# Altium project H743-Levels.PrjPcb
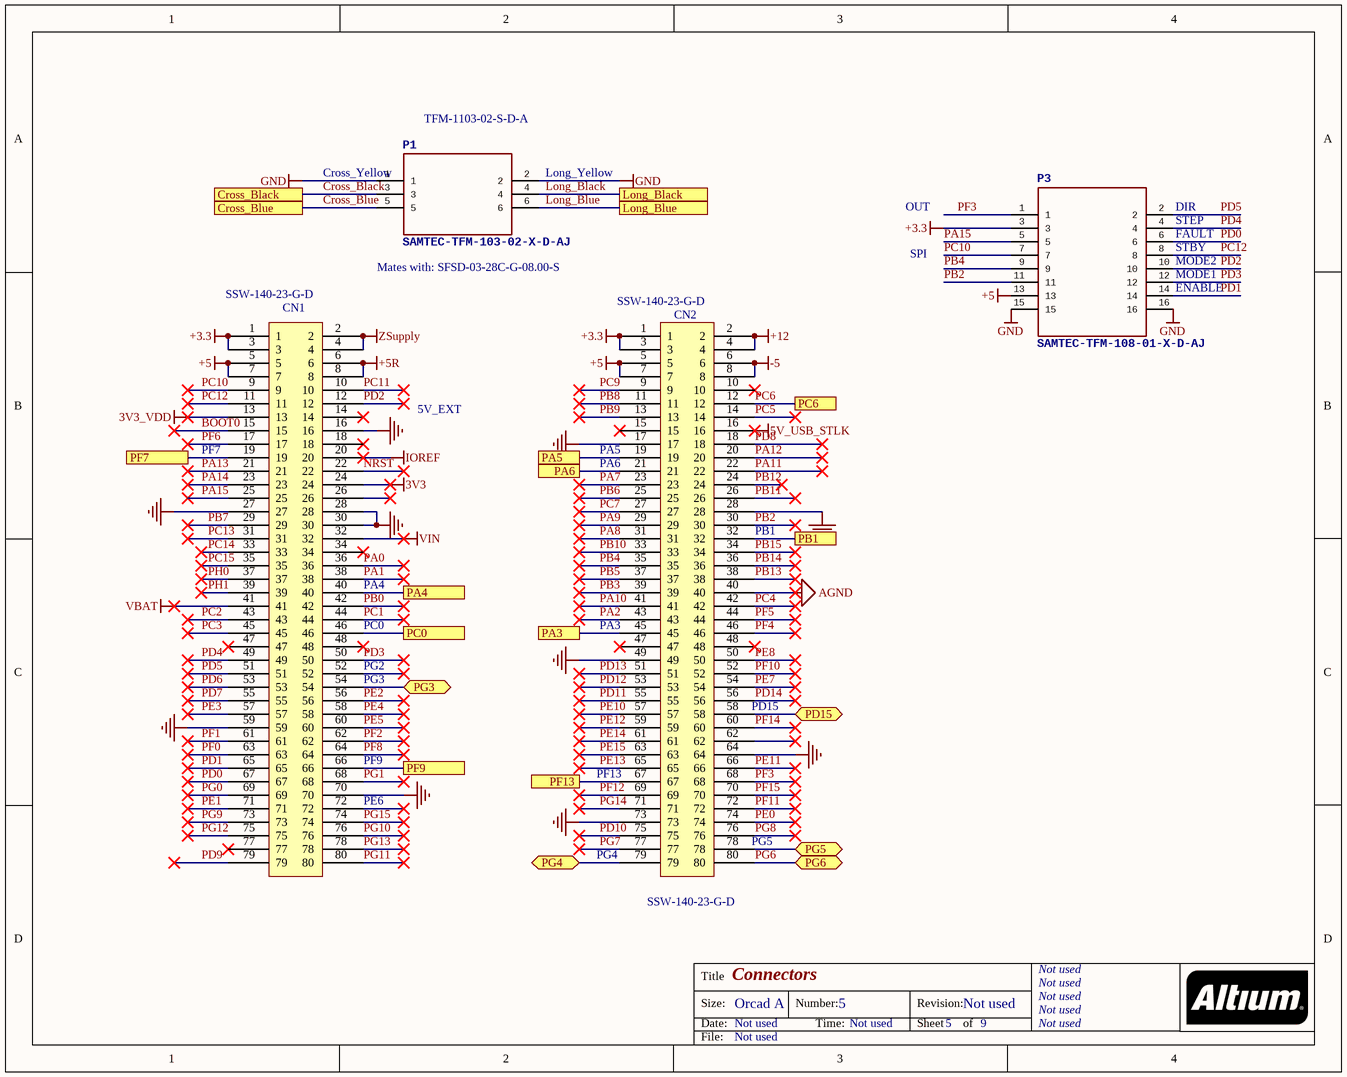
[diagram p0: Connectors.SchDoc]
Board_Assembly_Revision: 01; Board_Document_Date: 17-DEC-2018; Board_Name: NUCLEO 144 H7 LEGACY; Board_PCB_Revision: C; Board_Reference: MB1364
3 sheets, 66 parts. Net scope: flat (ports and power ports of the same name join across sheets).
Board file: MB1364.PcbDoc
Sheets:
  Connectors.SchDoc
  Levels.SchDoc
  Heaters.SchDoc

## Sheet Connectors.SchDoc: Connectors
size OrCAD A; Date: Not used; ApprovedBy: Not used; CheckedBy: Not used; Author: Not used; CompanyName: STMicroelectronics; DrawnBy: Not used; Engineer: Not used; Organization: Not used; Address1: Not used; Address2: Not used; Address3: Not used; Address4: Not used; DocumentNumber: 5; Revision: Not used; SheetNumber: 5; SheetTotal: 9; CurrentTime: Not used; CurrentDate: Not used; Time: Not used; DocumentFullPathAndName: Not used; DocumentName: Not used; ModifiedDate: Not used; ImagePath: Not used; ProjectName: Not used; Application_BuildNumber: Not used

### Parts
CN1  SSW-140-23-G-D  [SSW-140-23-G-D]
CN2  SSW-140-23-G-D  [SSW-140-23-G-D]
P1  SAMTEC-TFM-103-02-X-D-AJ  [SAMTEC-TFM-103-02-X-D-A]
P3  SAMTEC-TFM-108-01-X-D-AJ  [SAMTEC-TFM-108-01-X-D-A]

### Ports
Cross_Black, Cross_Blue, Long_Black, Long_Blue, PA3, PA4, PA5, PA6, PB1, PC0, PC6, PD15, PF7, PF9, PF13, PG3, PG4, PG5, PG6

### Nets
3V3: CN1.24
3V3_VDD: CN1.13
5V_USB_STLK: CN2.16
+3.3: CN1.1 CN1.3 CN2.1 CN2.3 P3.3
+5: CN1.5 CN1.7 CN2.5 CN2.7 P3.13
+5R: CN1.6 CN1.8
+12: CN2.2 CN2.4
-5: CN2.6 CN2.8
AGND: CN2.40
GND: CN1.16 CN1.27 CN1.28 CN1.30 CN1.59 CN1.70 CN2.17 CN2.28 CN2.49 CN2.64 CN2.73 P1.1 P1.2 P3.15 P3.16
IOREF: CN1.20
VBAT: CN1.41
VIN: CN1.32
ZSupply: CN1.2 CN1.4
BOOT0: CN1.15
Cross_Black: P1.3 ; port Cross_Black
Cross_Blue: P1.5 ; port Cross_Blue
Long_Black: P1.4 ; port Long_Black
Long_Blue: P1.6 ; port Long_Blue
NRST: CN1.22
PA0: CN1.36
PA1: CN1.38
PA2: CN2.43
PA3: CN2.45 ; port PA3
PA4: CN1.40 ; port PA4
PA5: CN2.19 ; port PA5
PA6: CN2.21 ; port PA6
PA7: CN2.23
PA8: CN2.31
PA9: CN2.29
PA10: CN2.41
PA11: CN2.22
PA12: CN2.20
PA13: CN1.21
PA14: CN1.23
PA15: CN1.25 P3.5
PB0: CN1.42
PB1: CN2.32 ; port PB1
PB2: CN2.30 P3.11
PB3: CN2.39
PB4: CN2.35 P3.9
PB5: CN2.37
PB6: CN2.25
PB7: CN1.29
PB8: CN2.11
PB9: CN2.13
PB10: CN2.33
PB11: CN2.26
PB12: CN2.24
PB13: CN2.38
PB14: CN2.36
PB15: CN2.34
PC0: CN1.46 ; port PC0
PC1: CN1.44
PC2: CN1.43
PC3: CN1.45
PC4: CN2.42
PC5: CN2.14
PC6: CN2.12 ; port PC6
PC7: CN2.27
PC9: CN2.9
PC10: CN1.9 P3.7
PC11: CN1.10
PC12: CN1.11 P3.8
PC13: CN1.31
PC14: CN1.33
PC15: CN1.35
PD0: CN1.67 P3.6
PD1: CN1.65 P3.14
PD2: CN1.12 P3.10
PD3: CN1.50 P3.12
PD4: CN1.49 P3.4
PD5: CN1.51 P3.2
PD6: CN1.53
PD7: CN1.55
PD8: CN2.18
PD9: CN1.79
PD10: CN2.75
PD11: CN2.55
PD12: CN2.53
PD13: CN2.51
PD14: CN2.56
PD15: CN2.58 ; port PD15
PE0: CN2.74
PE1: CN1.71
PE2: CN1.56
PE3: CN1.57
PE4: CN1.58
PE5: CN1.60
PE7: CN2.54
PE8: CN2.50
PE10: CN2.57
PE11: CN2.66
PE12: CN2.59
PE13: CN2.65
PE14: CN2.61
PE15: CN2.63
PF0: CN1.63
PF1: CN1.61
PF2: CN1.62
PF3: CN2.68 P3.1
PF4: CN2.46
PF5: CN2.44
PF6: CN1.17
PF7: CN1.19 ; port PF7
PF8: CN1.64
PF9: CN1.66 ; port PF9
PF10: CN2.52
PF11: CN2.72
PF12: CN2.69
PF13: CN2.67 ; port PF13
PF14: CN2.60
PF15: CN2.70
PG0: CN1.69
PG1: CN1.68
PG3: CN1.54 ; port PG3
PG4: CN2.79 ; port PG4
PG5: CN2.78 ; port PG5
PG6: CN2.80 ; port PG6
PG7: CN2.77
PG8: CN2.76
PG9: CN1.73
PG10: CN1.76
PG11: CN1.80
PG12: CN1.75
PG13: CN1.78
PG14: CN2.71
PG15: CN1.74
PH0: CN1.37
PH1: CN1.39

Not connected (* = marked no-connect by the designer): CN1 14* 18* 26* 34* 47* 48* 52* 72* 77*; CN2 10* 15* 47* 48* 62*

### Notes on the sheet
- TFM-1103-02-S-D-A
- (near P1) Cross_Yellow
- (near P1) Long_Yellow
- OUT
- (near P3) DIR
- Mates with: SFSD-03-28C-G-08.00-S
- SPI
- (near P3) STEP
- (near P3) FAULT
- (near P3) STBY
- (near P3) MODE2
- (near P3) MODE1
- (near P3) ENABLE
- 5V_EXT
- (near CN1) PF7
- (near CN2) PA6
- (near CN2) PA5
- (near CN2) PB1
- (near CN1) PA4
- (near CN1) PG2
- (near CN1) PG3
- (near CN1) PC0
- (near CN2) PA3
- (near CN2) PD15
- (near CN1) PE6
- (near CN1) PF9
- (near CN2) PF13
- (near CN2) PG4
- (near CN2) PG5
- Title
- Size:
- Date:
- Orcad A
- Number:
- Time:
- Revision:
- Sheet
- of
- File:

### Library data of the parts
CN1 CN2 = SSW-140-23-G-D: 80 Position Receptacle Connector Through Hole; Manufacturer: Samtec; Number of Contacts: 80; Gender: Female; Pitch: 2.54mm; Supplier 1: Avnet; Supplier Part Number 1: SSW-140-23-G-D; Manufacturer Part Number: SSW-140-23-G-D; Stock 1: 0; Pricing 1: 1=13.99000, 10=13.29000, 25=12.59000, 50=12.09000, 100=11.29000 (USD); RoHS: Yes; Mount: Through Hole; Contact Plating: Gold; Number of Rows: 2; Packaging: Bulk; Termination: Solder; Radiation Hardening: No; ComponentLink1URL: http://www.samtec.com/documents/webfiles/pdf/SSQ_TH.PDF?src-supplier=Avnet; ComponentLink1Description: http://www.samtec.com/documents/webfiles/pdf/SSQ_TH.PDF?src-supplier=Avnet

## Sheet Levels.SchDoc
size Tabloid
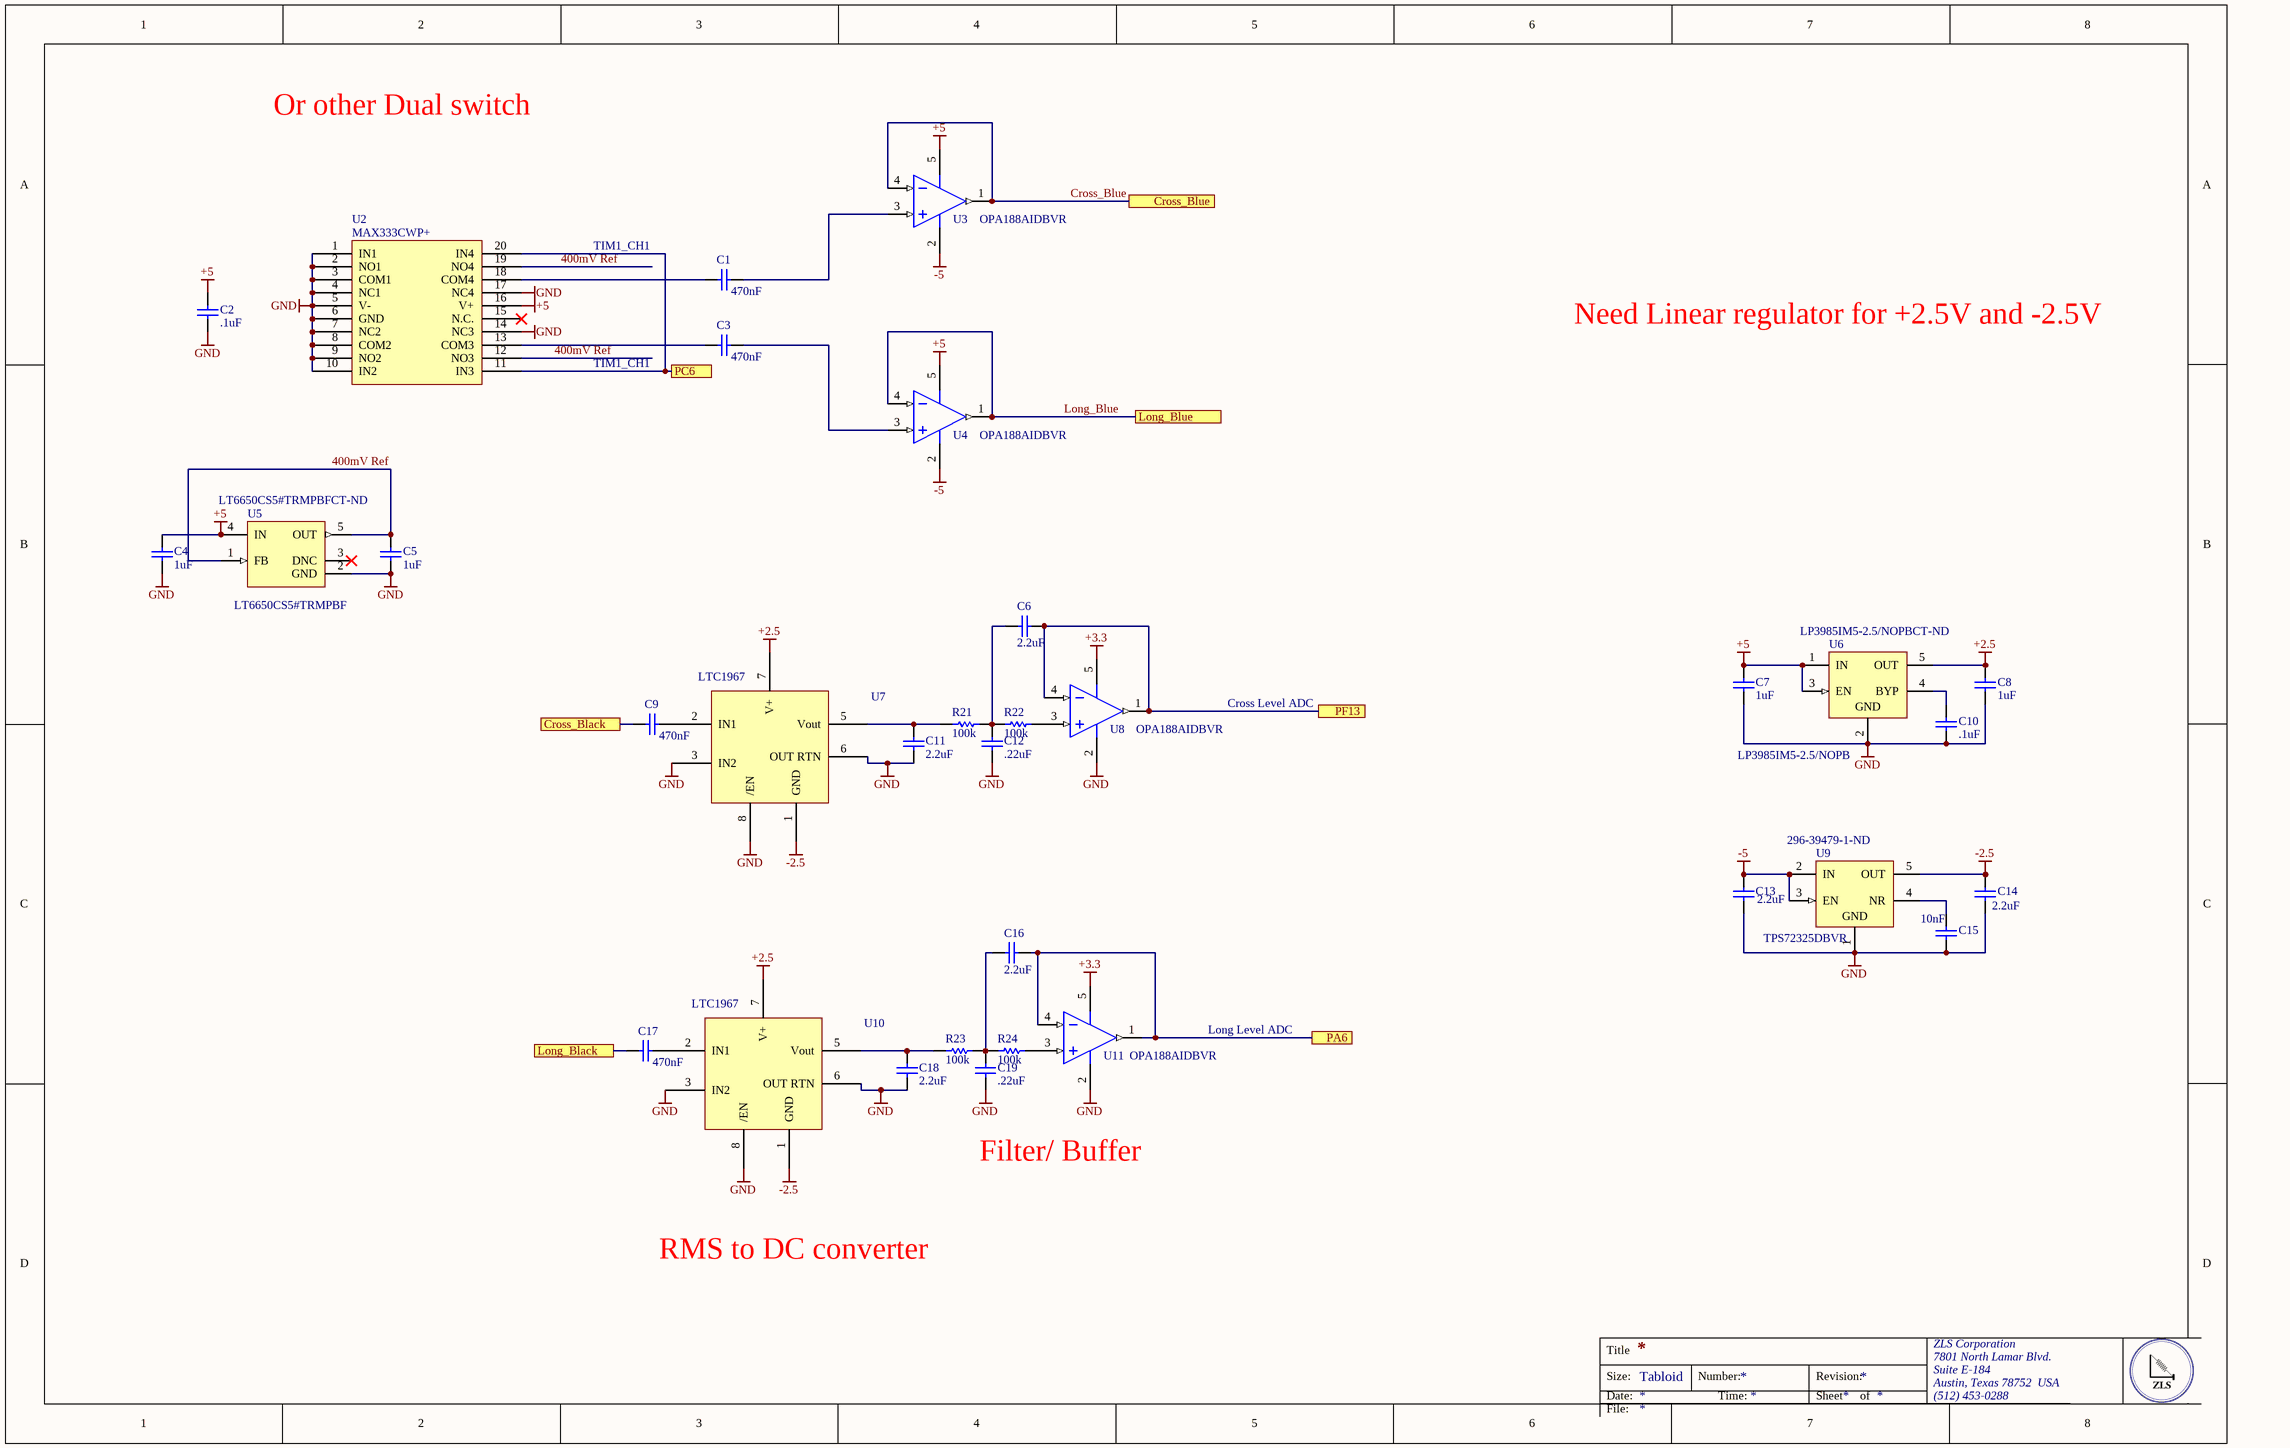
[diagram p1: Levels.SchDoc]

### Parts
C1  470nF  [CAPC0805(2012)75_L]
C2  .1uF  [CAPC0805(2012)75_L]
C3  470nF  [CAPC0805(2012)75_L]
C4  Capacitance: 1uF  [CAPC0805(2012)145_N]  (hidden comment: 08053C105JAT2A)
C5  Capacitance: 1uF  [CAPC0805(2012)145_N]  (hidden comment: 08053C105JAT2A)
C6  2.2uF  [CAPC0805(2012)75_L]
C7  Capacitance: 1uF  [CAPC0805(2012)145_N]  (hidden comment: 08053C105JAT2A)
C8  Capacitance: 1uF  [CAPC0805(2012)145_N]  (hidden comment: 08053C105JAT2A)
C9  470nF  [CAPC0805(2012)75_L]
C10  .1uF  [CAPC0805(2012)75_L]
C11  2.2uF  [CAPC0805(2012)75_L]
C12  .22uF  [CAPC0805(2012)75_L]
C13  Capacitance: 2.2uF  [CAPC2013X135X50ML10T20]  (hidden comment: GRM21BR71A225KA01L)
C14  Capacitance: 2.2uF  [CAPC2013X135X50ML10T20]  (hidden comment: GRM21BR71A225KA01L)
C15  Capacitance: 10nF  [CAPC2013X140X50NL20T25]  (hidden comment: 0805ZC103KAT2A)
C16  2.2uF  [CAPC0805(2012)75_L]
C17  470nF  [CAPC0805(2012)75_L]
C18  2.2uF  [CAPC0805(2012)75_L]
C19  .22uF  [CAPC0805(2012)75_L]
R21  100k  [RESC0805(2012)_L]
R22  100k  [RESC0805(2012)_L]
R23  100k  [RESC0805(2012)_L]
R24  100k  [RESC0805(2012)_L]
U2  MAX333CWP+  [TSOP65P640X90-20N]
U3  OPA188AIDBVR  [DBV0005A_M]
U4  OPA188AIDBVR  [DBV0005A_M]
U5  LT6650CS5#TRMPBF  Supplier Part Number 1: LT6650CS5#TRMPBFCT-ND  [LT-S5-5-TSOT-23_N]
U6  LP3985IM5-2.5/NOPB  Supplier Part Number 1: LP3985IM5-2.5/NOPBCT-ND  [DBV0005A_M]
U7  LTC1967  [LTC1967]
U8  OPA188AIDBVR  [DBV0005A_M]
U9  TPS72325DBVR  Supplier Part Number 1: 296-39479-1-ND  [DBV0005A_N]
U10  LTC1967  [LTC1967]
U11  OPA188AIDBVR  [DBV0005A_M]

### Ports
Cross_Black, Cross_Blue, Long_Black, Long_Blue, PA6, PC6, PF13

### Nets
+2.5: C8.2 U6.5(OUT) U7.7(V+) U10.7(V+)
+3.3: U8.5(V+) U11.5(V+)
+5: C2.2 C4.2 C7.2 U2.16(V+) U3.5(V+) U4.5(V+) U5.4(IN) U6.1(IN) U6.3(EN)
-2.5: C14.2 U7.1(GND) U9.5(OUT) U10.1(GND)
-5: C13.2 U3.2(V-) U4.2(V-) U9.2(IN) U9.3(EN)
GND: C2.1 C4.1 C5.1 C7.1 C8.1 C10.1 C11.1 C12.1 C13.1 C14.1 C15.1 C18.1 C19.1 U2.1(IN1) U2.2(NO1) U2.3(COM1) U2.4(NC1) U2.5(V-) U2.6(GND) U2.7(NC2) U2.8(COM2) U2.9(NO2) U2.10(IN2) U2.14(NC3) U2.17(NC4) U5.2(GND) U6.2(GND) U7.3(IN2) U7.6(OUT_RTN) U7.8(/EN) U8.2(V-) U9.1(GND) U10.3(IN2) U10.6(OUT_RTN) U10.8(/EN) U11.2(V-)
400mV Ref: C5.2 U2.12(NO3) U2.19(NO4) U5.1(FB) U5.5(OUT)
Cross_Black: C9.1 ; port Cross_Black
Cross_Blue: U3.1(OUT) U3.4(IN-) ; port Cross_Blue
Long_Black: C17.1 ; port Long_Black
Long_Blue: U4.1(OUT) U4.4(IN-) ; port Long_Blue
PA6: C16.1 U11.1(OUT) U11.4(IN-) ; port PA6
PC6: U2.11(IN3) U2.20(IN4) ; port PC6
PF13: C6.1 U8.1(OUT) U8.4(IN-) ; port PF13
NetC1_1: C1.1 U2.18(COM4)
NetC1_2: C1.2 U3.3(IN+)
NetC3_1: C3.1 U2.13(COM3)
NetC3_2: C3.2 U4.3(IN+)
NetC6_2: C6.2 C12.2 R21.1 R22.2
NetC9_2: C9.2 U7.2(IN1)
NetC10_2: C10.2 U6.4(BYP)
NetC11_2: C11.2 R21.2 U7.5(Vout)
NetC15_2: C15.2 U9.4(NR)
NetC16_2: C16.2 C19.2 R23.1 R24.2
NetC17_2: C17.2 U10.2(IN1)
NetC18_2: C18.2 R23.2 U10.5(Vout)
NetR22_1: R22.1 U8.3(IN+)
NetR24_1: R24.1 U11.3(IN+)

Not connected (* = marked no-connect by the designer): U2 15(N.C.)*; U5 3(DNC)*; U7 4(NC); U10 4(NC)

### Notes on the sheet
- Or other Dual switch
- TIM1_CH1
- Need Linear regulator for +2.5V and -2.5V
- Cross Level ADC
- Long Level ADC
- Filter/ Buffer
- RMS to DC converter
- Title
- Size:
- Date:
- Tabloid
- Number:
- Time:
- Revision:
- Sheet
- of
- ZLS Corporation
- 7801 North Lamar Blvd.
- Suite E-184
- Austin, Texas 78752  USA
- (512) 453-0288
- File:

### Library data of the parts
C1 C3 C9 C17 = CMP-1036-02117-1: CAP 150pF 16V ±10% 0805 (2012 Metric) Thickness 0.75mm SMD; Case-EIA: 0805; Tolerance: Â±10%; Value: .47uF; Case-Metric: 2012; Technology: SMT; Max Thickness: 0.75 mm; Rated Voltage: 16 V
C2 = CMP-1036-02117-1: CAP 150pF 16V ±10% 0805 (2012 Metric) Thickness 0.75mm SMD; Case-EIA: 0805; Tolerance: Â±10%; Case-Metric: 2012; Technology: SMT; Max Thickness: 0.75 mm; Rated Voltage: 16 V; Value: .1uF
C4 C5 C7 C8 = CMP-1036-04752-1: 1µF ±5% 25V Ceramic Capacitor X7R 0805 (2012 Metric); Manufacturer: Kyocera AVX; Tolerance: Â±5%; Case-Metric: 2012; Case-EIA: 0805; Value: 1uF; Technology: SMT; Rated Voltage: 25 V; Max Thickness: 1.45 mm; Supplier 1: Digi-Key; Supplier Part Number 1: 478-10487-1-ND; Manufacturer Part Number: 08053C105JAT2A; Stock 1: 13701; Pricing 1: 1=0.44000, 10=0.30400, 100=0.18220, 500=0.13662, 1000=0.11537 (USD); RoHS: Yes; Mount: Surface Mount; Case/Package: 0805; Number of Pins: 2; Case Code (Metric): 2012; Case Code (Imperial): 0805; Contact Plating: Tin; Min Operating Temperature: -55°C; Max Operating Temperature: 125°C; Packaging: Tape and Reel; Voltage Rating: 25V; Package Quantity: 2000; Dielectric: X7R; Voltage Rating (DC): 25V; Termination: SMD/SMT; Length: 2.01mm; Height: 1.4mm; Width: 0.049inch; Thickness: 0.037inch; Depth: 1.25mm; Radiation Hardening: No; Lead Free: Lead Free; REACH SVHC: Unknown; ComponentLink1URL: https://datasheet.ciiva.com/221/cx7r-221690.pdf?src-supplier=Digi-Key; ComponentLink1Description: https://datasheet.ciiva.com/221/cx7r-221690.pdf?src-supplier=Digi-Key; ComponentLink2URL: https://datasheet.ciiva.com/5419/cx7r-218113-5419770.pdf?src-supplier=Mouser; ComponentLink2Description: https://datasheet.ciiva.com/5419/cx7r-218113-5419770.pdf?src-supplier=Mouser; ComponentLink3URL: https://datasheet.ciiva.com/28586/1679506-28586091.pdf?src-supplier=Element14; ComponentLink3Description: https://datasheet.ciiva.com/28586/1679506-28586091.pdf?src-supplier=Element14; ComponentLink4URL: https://datasheet.ciiva.com/11499/cx7r-11499836.pdf?src-supplier=Avnet; ComponentLink4Description: https://datasheet.ciiva.com/11499/cx7r-11499836.pdf?src-supplier=Avnet
C6 C11 C12 C16 C18 C19 = CMP-1036-02117-1: CAP 150pF 16V ±10% 0805 (2012 Metric) Thickness 0.75mm SMD; Case-EIA: 0805; Tolerance: Â±10%; Value: 1uF; Case-Metric: 2012; Technology: SMT; Max Thickness: 0.75 mm; Rated Voltage: 16 V
C10 = CMP-1036-02117-1: 0.1µF ±10% 25V Ceramic Capacitor X7R 0805 (2012 Metric); Manufacturer: Vishay; Manufacturer Part Number: VJ0805Y104KXXCW1BC; Dielectric Material: Tantalum; Capacitance: 100nF; Supplier 1: Digi-Key; Supplier Part Number 1: 720-1537-1-ND; Stock 1: 72674; Pricing 1: 1=0.26000, 10=0.17900, 100=0.10120, 500=0.07142, 1000=0.06250 (USD); RoHS: Yes; Mount: Surface Mount; Case/Package: 0805; Number of Pins: 2; Weight: 0.000194oz; Case Code (Imperial): 0805; Case Code (Metric): 2012; Min Operating Temperature: -55°C; Max Operating Temperature: 125°C; Tolerance: 10%; Packaging: Tape and Reel; Package Quantity: 4000; Voltage Rating: 25V; Dielectric: X7R; Voltage Rating (DC): 25V; Termination: SMD/SMT; Length: 2mm; Height: 1.45mm; Width: 1.25mm; Thickness: 0.037inch; Depth: 1.25mm; Lead Free: Lead Free; ComponentLink1URL: https://datasheet.ciiva.com/11491/vjw1bcbascomseries-11491758.pdf?src-supplier=Avnet; ComponentLink1Description: https://datasheet.ciiva.com/11491/vjw1bcbascomseries-11491758.pdf?src-supplier=Avnet; ComponentLink2URL: https://datasheet.ciiva.com/176/vjw1bcbascomseries-176875.pdf?src-supplier=Digi-Key; ComponentLink2Description: https://datasheet.ciiva.com/176/vjw1bcbascomseries-176875.pdf?src-supplier=Digi-Key
C13 C14 = CMP-2007-03454-1: 2.2µF ±10% 10V Ceramic Capacitor X7R 0805 (2012 Metric); Manufacturer: Murata; Dissipation Factor: 0.035%; Part Number: GRM21BR71A225KA01L; Supplier 1: Digi-Key; Supplier Part Number 1: 490-1696-1-ND; Manufacturer Part Number: GRM21BR71A225KA01L; Stock 1: 271684; Pricing 1: 1=0.27000, 10=0.18600, 100=0.09440, 500=0.06458, 1000=0.05713 (USD); RoHS: Yes; Mount: Surface Mount; Case/Package: 0805; Number of Pins: 2; Case Code (Imperial): 0805; Case Code (Metric): 2012; Min Operating Temperature: -55°C; Max Operating Temperature: 125°C; Tolerance: 10%; Packaging: Tape and Reel; Package Quantity: 1; Voltage Rating: 10V; Dielectric: X7R; Voltage Rating (DC): 10V; Termination: SMD/SMT; Voltage: 10V; Length: 2mm; Height: 1.25mm; Width: 1.25mm; Thickness: 0.053inch; Depth: 1.25mm; Radiation Hardening: No; REACH SVHC: No SVHC; Lead Free: Lead Free; ComponentLink1URL: https://datasheet.ciiva.com/2989/product-2989712.pdf?src-supplier=Avnet; ComponentLink1Description: https://datasheet.ciiva.com/2989/product-2989712.pdf?src-supplier=Avnet; ComponentLink2URL: https://datasheet.ciiva.com/3778/grm21br71a225ka0123-3778504.pdf?src-supplier=Arrow; ComponentLink2Description: https://datasheet.ciiva.com/3778/grm21br71a225ka0123-3778504.pdf?src-supplier=Arrow; ComponentLink3URL: https://datasheet.ciiva.com/11786/0900766b80936815-11786251.pdf?src-supplier=RSComponents; ComponentLink3Description: https://datasheet.ciiva.com/11786/0900766b80936815-11786251.pdf?src-supplier=RSComponents; ComponentLink4URL: https://datasheet.ciiva.com/16203/product-16203815.pdf?src-supplier=Future+Electronics; ComponentLink4Description: https://datasheet.ciiva.com/16203/product-16203815.pdf?src-supplier=Future+Electronics; ComponentLink5URL: https://datasheet.ciiva.com/135/partnumbering-e-01-135064.pdf?src-supplier=Digi-Key; ComponentLink5Description: https://datasheet.ciiva.com/135/partnumbering-e-01-135064.pdf?src-supplier=Digi-Key; ComponentLink6URL: https://datasheet.ciiva.com/135/partnumbering-e-01-135065.pdf?src-supplier=Digi-Key; ComponentLink6Description: https://datasheet.ciiva.com/135/partnumbering-e-01-135065.pdf?src-supplier=Digi-Key; ComponentLink7URL: https://datasheet.ciiva.com/135/partnumbering-e-01-135066.pdf?src-supplier=Digi-Key; ComponentLink7Description: https://datasheet.ciiva.com/135/partnumbering-e-01-135066.pdf?src-supplier=Digi-Key; ComponentLink8URL: https://datasheet.ciiva.com/22703/608985-22703358.pdf?src-supplier=Element14; ComponentLink8Description: https://datasheet.ciiva.com/22703/608985-22703358.pdf?src-supplier=Element14; ComponentLink9URL: https://datasheet.ciiva.com/2989/product-2989711.pdf?src-supplier=Avnet; ComponentLink9Description: https://datasheet.ciiva.com/2989/product-2989711.pdf?src-supplier=Avnet
C15 = CMP-2007-04770-1: 10000pF ±10% 10V Ceramic Capacitor X7R 0805 (2012 Metric); Manufacturer: AVX Interconnect / Elco; Part Number: 0805ZC103KAT2A; Supplier 1: Digi-Key; Supplier Part Number 1: 478-11396-1-ND; Manufacturer Part Number: 0805ZC103KAT2A; Stock 1: 11980; Pricing 1: 1=0.32000, 10=0.21700, 100=0.11010, 500=0.07534, 1000=0.06665 (USD); RoHS: Yes; Mount: Surface Mount; Case/Package: 0805; Number of Pins: 2; Case Code (Metric): 2012; Case Code (Imperial): 0805; Min Operating Temperature: -55°C; Max Operating Temperature: 125°C; Tolerance: 10%; Packaging: Tape and Reel; Termination: SMD/SMT; Package Quantity: 4000; Dielectric: X7R; Voltage Rating (DC): 10V; Voltage Rating: 10V; Length: 2.01mm; Width: 0.049inch; Depth: 1.25mm; Thickness: 0.037inch; Radiation Hardening: No; REACH SVHC: Unknown; ComponentLink1URL: https://datasheet.ciiva.com/205/cx7r-205251.pdf?src-supplier=Digi-Key; ComponentLink1Description: https://datasheet.ciiva.com/205/cx7r-205251.pdf?src-supplier=Digi-Key; ComponentLink2URL: https://datasheet.ciiva.com/11508/cx7r-11508056.pdf?src-supplier=Avnet; ComponentLink2Description: https://datasheet.ciiva.com/11508/cx7r-11508056.pdf?src-supplier=Avnet; ComponentLink3URL: https://datasheet.ciiva.com/17489/cx7r-17489036.pdf?src-supplier=Avnet+Europe; ComponentLink3Description: https://datasheet.ciiva.com/17489/cx7r-17489036.pdf?src-supplier=Avnet+Europe; ComponentLink4URL: https://datasheet.ciiva.com/5420/cx7r-5420079.pdf?src-supplier=Mouser; ComponentLink4Description: https://datasheet.ciiva.com/5420/cx7r-5420079.pdf?src-supplier=Mouser
R21-R24 = CMP-1013-00215-1: 2R55 0.125W 1% 0805 (2012 Metric)  SMD; Case-Metric: 2012; Case-EIA: 0805; Value: 100k; Tolerance: 1 %; Technology: SMT; Power: 0.125 W
U2 = MAX333CWP+: IC SWITCH QUAD SPDT 20TSSOP; Manufacturer: Maxim; Manufacturer Part Number: MAX333AEUP+; Max Supply Voltage: 30V; Min Supply Voltage: 10V; Min Dual Supply Voltage: 4.5V; Max Dual Supply Voltage: 20V; On-State Resistance: 35R; Operating Supply Current: 1uA; Supply Type: Single,Dual; Max Power Dissipation: 559mW; Turn-On Delay Time: 175ns; Turn-Off Delay Time: 145ns; Max Supply Current: 250uA; Number of Bits: 4; Dual Supply Voltage: 15V; Supplier 1: Mouser; Supplier Part Number 1: 700-MAX333AEUP; Stock 1: 664; Pricing 1: 1=6.77, 10=6.43, 50=5.8, 100=5.8, 1000=5.62, 10000=5.62 (USD); Case/Package: TSSOP; Number of Pins: 20; Weight: 0.006737oz; Min Operating Temperature: -40°C; Max Operating Temperature: 85°C; Packaging: Rail/Tube; Package Quantity: 74; Throw Configuration: SPDT; Number of Channels: 4; Length: 6.6mm; Height: 0.95mm; Width: 4.5mm; Radiation Hardening: No; Lead Free: Lead Free; REACH SVHC: Unknown; ComponentLink1URL: https://datasheet.ciiva.com/2978/max333a-2978850.pdf; ComponentLink1Description: https://datasheet.ciiva.com/2978/max333a-2978850.pdf; ComponentLink2URL: https://datasheet.ciiva.com/30478/0900766b81253c85-30478260.pdf; ComponentLink2Description: https://datasheet.ciiva.com/30478/0900766b81253c85-30478260.pdf; ComponentLink3URL: https://datasheet.ciiva.com/1674/max333a-1674617.pdf; ComponentLink3Description: https://datasheet.ciiva.com/1674/max333a-1674617.pdf; ComponentLink4URL: https://datasheet.ciiva.com/26825/max333aeup-26825546.pdf; ComponentLink4Description: https://datasheet.ciiva.com/26825/max333aeup-26825546.pdf
U3 U4 U8 U11 = CMP-0809-00005-2: Precision, Low Noise, Rail-to-Rail Output, Zero-Drift Operational Amplifier, 4 to 36 V, -40 to 125 degC, 5-pin SOT23 (DBV5), Green (RoHS & no Sb/Br); Manufacturer: Texas Instruments; Total Supply Voltage(Min)(+5V is 5, +/-5V is 10): 4; Offset Drift(Typ)(uV/C): 0.03; Rating: Catalog; SubFamily: Zero Drift Precision Amplifier; GBW(Typ)(MHz): 2; Slew Rate(Typ)(V/us): 0.8; Number of Channels: 1; CMRR(Min)(dB): 120; Iq per channel(Max)(mA): 0.51; Total Supply Voltage(Max)(+5V is 5, +/-5V is 10): 36; PartNumber: OPA188AIDBVR; ComponentLink2Description: Datasheet; ComponentLink2URL: http://www.ti.com/lit/ds/symlink/opa188.pdf; ComponentLink1Description: Manufacturer URL; Mounting Technology: Surface Mount; Eco-Plan: Green (RoHS & no Sb/Br); ComponentLink1URL: http://www.ti.com/; PackageVersion: 4073253-4/K, 03/2006; DatasheetVersion: SBOS642A; ComponentLink3Description: Package Specification; PackageReference: DBV0005A; ComponentLink3URL: http://www.ti.com/litv/pdf/mpds018i; PackageDescription: 5-Pin Plastic Small Outline, Body 1.6 x 2.9 mm, Pitch 0.95 mm; Code_JEDEC: MO-178
U5 = CMP-1567-00007-1: Micropower, 400 mV Reference with Rail-to-Rail Buffer Amplifier, 1.4 to 18 V, 0 to 70 degC, 5-Pin SOT-23 (S5), RoHS, Tape and Reel; Manufacturer: Analog Devices / Linear Technology; VIN Max: 18 V; VIN Min: 1.4 V; Number of Channels: 1; Tolerance: 0.75%; Max Input Voltage: 18V; Min Input Voltage: 1.4V; Output Voltage: 400mV; Temperature Coefficient: 30ppm/°C; Quiescent Current: 15uA; Output Current: 200uA; Reference Type: Series; PackageVersion: Rev. B, 06/2010; ComponentLink1Description: Manufacturer URL; Mounting Technology: Surface Mount; PartNumber: LT6650CS5#TRMPBF; Packing: Tape and Reel; PackageDescription: 5-Pin Plastic Thin Small Out-Line Transistor, Body 1.63 x 2.90 mm, Pitch 0.95 mm; Code_JEDEC: MO-193; Temperature Max: 70 degC; ComponentLink2Description: Datasheet; ComponentLink2URL: http://cds.linear.com/docs/en/datasheet/6650fa.pdf; ComponentLink3URL: http://cds.linear.com/docs/en/packaging/SOT_5_05-08-1635.pdf; ComponentLink1URL: http://www.linear.com/; RoHS: TRUE; ComponentLink3Description: Package Specification; Temperature Min: 0 degC; Supplier 1: Digi-Key; Manufacturer Part Number: LT6650CS5#TRMPBF; Stock 1: 3771; Pricing 1: 1=3.18000, 25=2.11040, 100=1.74480, 250=1.65756 (USD); Case/Package: SOT-23-5; Number of Pins: 5; Min Operating Temperature: 0°C; Max Operating Temperature: 70°C; Package Quantity: 1; Packaging: Tape and Reel; Length: 2.9mm; Height: 0.9mm; Width: 1.75mm; Lead Free: Lead Free; ComponentLink4URL: https://datasheet.ciiva.com/6594/1196-6594366.pdf?src-supplier=Digi-Key; ComponentLink4Description: https://datasheet.ciiva.com/6594/1196-6594366.pdf?src-supplier=Digi-Key; ComponentLink5URL: https://datasheet.ciiva.com/48694/001256472-da-01-en-ic-vref-s-lt6650cs5-trmpbf-tsot-23-5-ltc-48694695.pdf?src-supplier=Conrad; ComponentLink5Description: https://datasheet.ciiva.com/48694/001256472-da-01-en-ic-vref-s-lt6650cs5-trmpbf-tsot-23-5-ltc-48694695.pdf?src-supplier=Conrad
U6 = CMP-0062-01907-3: Micropower, 150mA Low-Noise Ultra Low-Dropout CMOS Voltage Regulator, 5-pin SOT-23, Pb-Free; Manufacturer: Texas Instruments; PackageTopMarking: LCSB*XTT; PowerWise: N; CompType: LDO IC; Max Input Voltage: 6V; Output Voltage: 2.5V; Number of Outputs: 1; Max Power Dissipation: 250mW; Polarity: Positive; Quiescent Current: 150uA; Accuracy: 2%; Output Type: Fixed; Dropout Voltage: 60mV; Current Rating: 150A; ComponentLink1Description: Datasheet URL; PinCount: 5; RoHS: Y; PackageDescription: Molded SOT-23, .115 x .063 x .040 in Body, 5 Lead, .0375 in Pitch; ComponentLink1URL: http://www.ti.com/general/docs/lit/getliterature.tsp?genericPartNumber=LP3985&fileType=pdf; PackageReference: DBV0005A; Supplier 1: Digi-Key; Manufacturer Part Number: LP3985IM5-2.5/NOPB; Stock 1: 16680; Pricing 1: 1=0.66000, 10=0.57800, 100=0.44300, 500=0.35020 (USD); Mount: Surface Mount; Case/Package: SOT-23; Number of Pins: 5; Contact Plating: Tin; Min Operating Temperature: -40°C; Max Operating Temperature: 125°C; Max Output Current: 150mA; Min Input Voltage: 2.5V; Output Current: 150mA; Packaging: Tape and Reel; Power Dissipation: 250mW; Output Voltage Accuracy: 2%; Nominal Output Voltage: 2.5V; Termination: SMD/SMT; Max Supply Voltage: 6V; Min Supply Voltage: 2.5V; Max Output Voltage: 2.5V; Length: 2.92mm; Height: 1.02mm; Width: 1.6mm; Lead Free: Lead Free; REACH SVHC: No SVHC; ComponentLink2URL: https://datasheet.ciiva.com/46441/10171-46441111.pdf?src-supplier=Element14; ComponentLink2Description: https://datasheet.ciiva.com/46441/10171-46441111.pdf?src-supplier=Element14; ComponentLink3URL: https://datasheet.ciiva.com/49047/1882660-49047100.pdf?src-supplier=Element14; ComponentLink3Description: https://datasheet.ciiva.com/49047/1882660-49047100.pdf?src-supplier=Element14; ComponentLink4URL: https://datasheet.ciiva.com/46383/1882660-46383391.pdf?src-supplier=Element14; ComponentLink4Description: https://datasheet.ciiva.com/46383/1882660-46383391.pdf?src-supplier=Element14
U7 U10 = LTC1967: IC CONVERTER RMS-DC PREC 9MSOP
U9 = CMP-0394-00292-2: Single Output High PSRR LDO, 200 mA, Fixed -2.5 V Output, -10 to -2.7 V Input, 5-pin SOT-23 (DBV), -40 to 125 degC, Green (RoHS & no Sb/Br); Manufacturer: Texas Instruments; Iout(Max)(A): 0.2; Iq(Typ)(mA): 0.13; Accuracy(%): 2; Vdo(Typ)(mV): 280; SubFamily: Single Channel LDO; Number of Outputs: 1; Output Voltage: -2.5V; Max Power Dissipation: 560mW; Dropout Voltage: 280mV; Output Current: 200mA; Max Input Voltage: -2.7V; Min Input Voltage: -10V; Min Current Limit: 300mA; Input Bias Current: 130uA; Polarity: Negative; Output Voltage Accuracy: 1%; Accuracy: 2%; Vin(Max)(V): -2.7; PartNumber: TPS72325DBVR; PackageReference: DBV0005A; ComponentLink3Description: Package Specification; Fixed Output Options(V): -2.5; ComponentLink1URL: http://www.ti.com/; ComponentLink1Description: Manufacturer URL; Mounting Technology: Surface Mount; PackageDescription: 5-Pin Plastic Small Outline, Body 1.60 Ãƒâ€” 2.90 mm, Pitch 0.95 mm; ComponentLink2URL: http://www.ti.com/general/docs/lit/getliterature.tsp?genericPartNumber=TPS72325&fileType=pdf; PackageVersion: 4073253-4/K; ComponentLink3URL: http://www.ti.com/litv/pdf/mpds018i; Vout Adj(Min)(V): -2.5; ComponentLink2Description: Datasheet; Vout Adj(Max)(V): -2.5; Eco-Plan: Green (RoHS & no Sb/Br); DatasheetVersion: SLVS346B; Vin(Min)(V): -10; Code_JEDEC: MO-178; Supplier 1: Digi-Key; Manufacturer Part Number: TPS72325DBVR; Stock 1: 6951; Pricing 1: 1=2.81000, 10=2.52200, 100=2.02720, 500=1.66552, 1000=1.37999 (USD); RoHS: Yes; Case/Package: SOT-23; Number of Pins: 5; Contact Plating: Tin; Min Operating Temperature: -40°C; Max Operating Temperature: 125°C; Packaging: Tape and Reel; Package Quantity: 3000; Max Output Current: 200mA; Number of Regulators: 1; Power Dissipation: 560mW; Min Output Voltage: -2.5V; Quiescent Current: 130uA; Max Output Voltage: -2.5V; Output Type: Fixed; Nominal Output Voltage: -2.5V; Radiation Hardening: No; Lead Free: Lead Free; REACH SVHC: No SVHC; ComponentLink4URL: http://www.mouser.com/ds/2/405/slvs346c-521947.pdf?src-supplier=Mouser; ComponentLink4Description: http://www.mouser.com/ds/2/405/slvs346c-521947.pdf?src-supplier=Mouser; ComponentLink5URL: http://components.arrow.com/part/dataview/0323_00141856?src-supplier=Arrow+Europe; ComponentLink5Description: http://components.arrow.com/part/dataview/0323_00141856?src-supplier=Arrow+Europe; ComponentLink6URL: http://www.ti.com/general/docs/lit/getliterature.tsp?genericPartNumber=TPS723&amp;&amp;fileType=pdf&src-supplier=Newark; ComponentLink6Description: http://www.ti.com/general/docs/lit/getliterature.tsp?genericPartNumber=TPS723&amp;&amp;fileType=pdf&src-supplier=Newark; ComponentLink7URL: http://focus.ti.com/lit/ds/symlink/tps72325.pdf?src-supplier=Avnet+Europe; ComponentLink7Description: http://focus.ti.com/lit/ds/symlink/tps72325.pdf?src-supplier=Avnet+Europe; ComponentLink8URL: http://www.ti.com/general/docs/lit/getliterature.tsp?genericPartNumber=TPS723&amp;&amp;fileType=pdf&src-supplier=Farnell; ComponentLink8Description: http://www.ti.com/general/docs/lit/getliterature.tsp?genericPartNumber=TPS723&amp;&amp;fileType=pdf&src-supplier=Farnell; ComponentLink9URL: http://www.ti.com/general/docs/lit/getliterature.tsp?genericPartNumber=TPS723&&fileType=pdf&src-supplier=Avnet+Asia; ComponentLink9Description: http://www.ti.com/general/docs/lit/getliterature.tsp?genericPartNumber=TPS723&&fileType=pdf&src-supplier=Avnet+Asia; ComponentLink10URL: http://www.ti.com/general/docs/lit/getliterature.tsp?genericPartNumber=TPS723&&fileType=pdf&src-supplier=Avnet; ComponentLink10Description: http://www.ti.com/general/docs/lit/getliterature.tsp?genericPartNumber=TPS723&&fileType=pdf&src-supplier=Avnet; ComponentLink11URL: http://components.arrow.com/part/dataview/40177093S9611537N7713?src-supplier=Arrow; ComponentLink11Description: http://components.arrow.com/part/dataview/40177093S9611537N7713?src-supplier=Arrow; ComponentLink12URL: http://www.ti.com/lit/ds/symlink/tps723.pdf?src-supplier=Digi-Key; ComponentLink12Description: http://www.ti.com/lit/ds/symlink/tps723.pdf?src-supplier=Digi-Key; ComponentLink13URL: http://www.ti.com/general/docs/lit/getliterature.tsp?genericPartNumber=TPS723&&fileType=pdf&src-supplier=Element14; ComponentLink13Description: http://www.ti.com/general/docs/lit/getliterature.tsp?genericPartNumber=TPS723&&fileType=pdf&src-supplier=Element14; ComponentLink14URL: http://www.ti.com/lit/ds/symlink/tps72301.pdf?src-supplier=Digi-Key; ComponentLink14Description: http://www.ti.com/lit/ds/symlink/tps72301.pdf?src-supplier=Digi-Key

## Sheet Heaters.SchDoc: Land Meter Heater Assembly
size Tabloid; DocumentNumber: LM_HTR_001; Revision: A; SheetNumber: 1; SheetTotal: 1
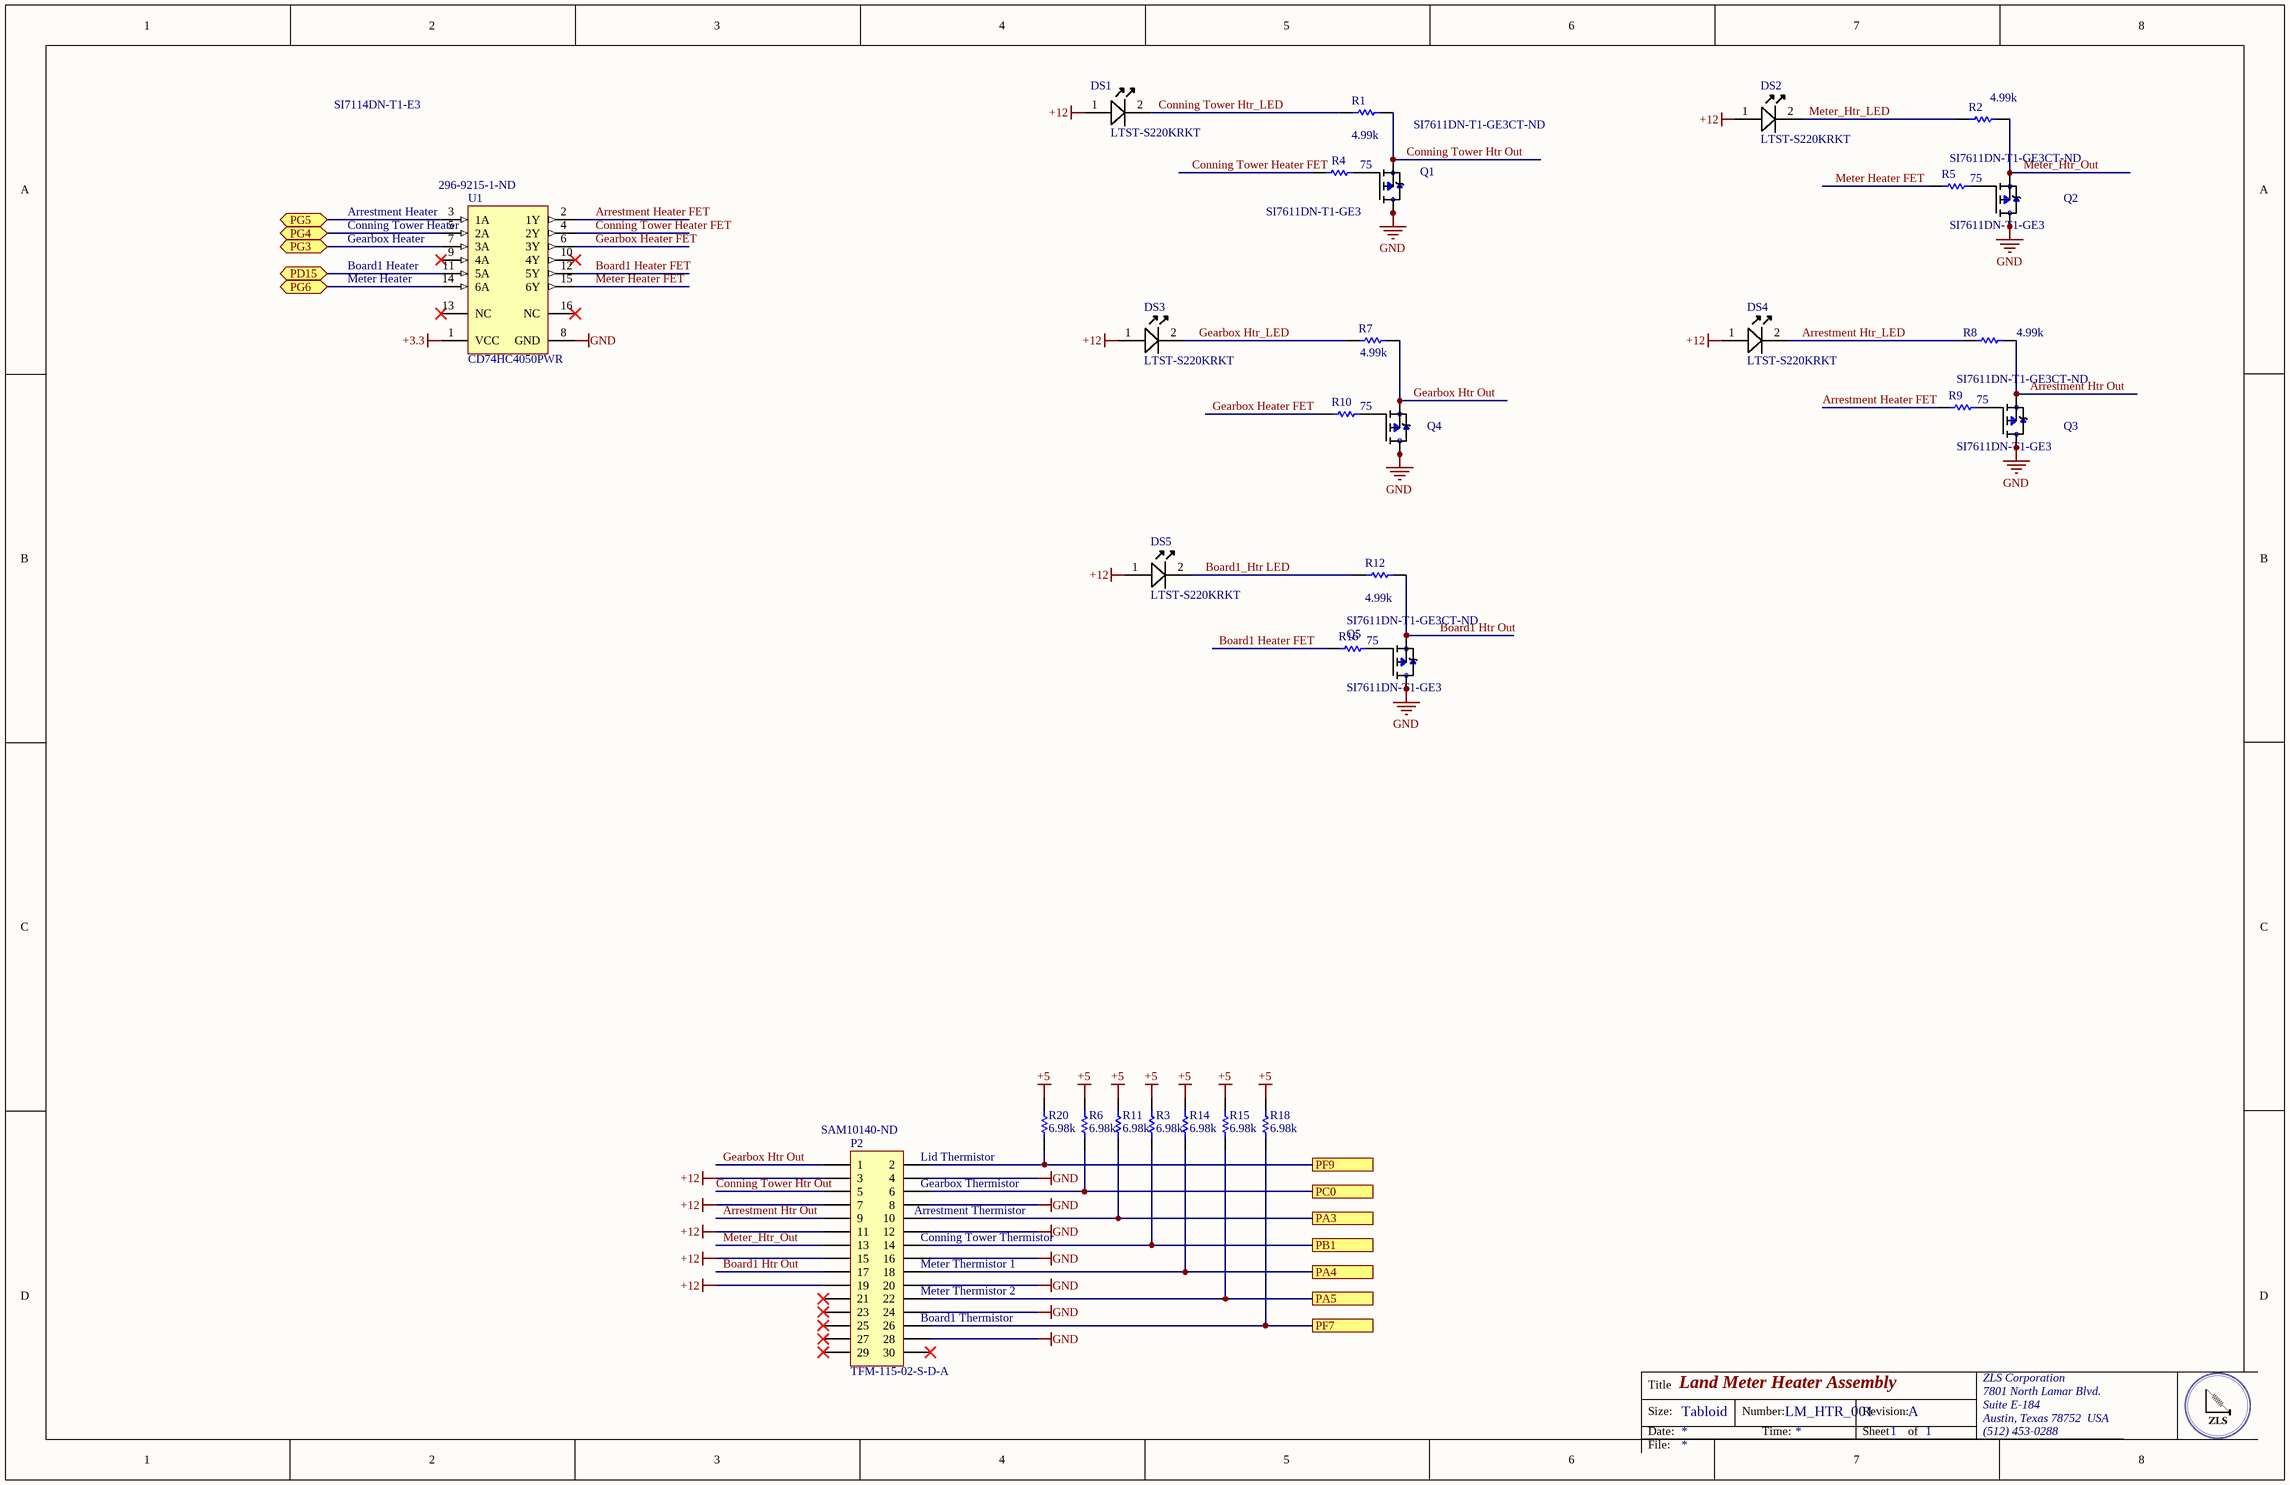
[diagram p2: Heaters.SchDoc]

### Parts
DS1  Manufacturer Part Number: LTST-S220KRKT  [0805C_L]  (hidden comment: Visible Name Value Type    False Description Lite-On LTST-S220KRKT Red LED, 631 nm 2012 (0805) Side View, Rectangle Lens SMD package STRING)
DS2  Manufacturer Part Number: LTST-S220KRKT  [0805C_L]  (hidden comment: Visible Name Value Type    False Description Lite-On LTST-S220KRKT Red LED, 631 nm 2012 (0805) Side View, Rectangle Lens SMD package STRING)
DS3  Manufacturer Part Number: LTST-S220KRKT  [0805C_L]  (hidden comment: Visible Name Value Type    False Description Lite-On LTST-S220KRKT Red LED, 631 nm 2012 (0805) Side View, Rectangle Lens SMD package STRING)
DS4  Manufacturer Part Number: LTST-S220KRKT  [0805C_L]  (hidden comment: Visible Name Value Type    False Description Lite-On LTST-S220KRKT Red LED, 631 nm 2012 (0805) Side View, Rectangle Lens SMD package STRING)
DS5  Manufacturer Part Number: LTST-S220KRKT  [0805C_L]  (hidden comment: Visible Name Value Type    False Description Lite-On LTST-S220KRKT Red LED, 631 nm 2012 (0805) Side View, Rectangle Lens SMD package STRING)
P2  TFM-115-02-S-D-A  Supplier Part Number 1: SAM10140-ND  [TFM-115-02-S-D-A - duplicate]
Q1  SI7611DN-T1-GE3  Supplier Part Number 1: SI7611DN-T1-GE3CT-ND  [*VISHAY_SIS468DN-T1-GE3]
Q2  SI7611DN-T1-GE3  Supplier Part Number 1: SI7611DN-T1-GE3CT-ND  [*VISHAY_SIS468DN-T1-GE3]
Q3  SI7611DN-T1-GE3  Supplier Part Number 1: SI7611DN-T1-GE3CT-ND  [*VISHAY_SIS468DN-T1-GE3]
Q4  SI7611DN-T1-GE3  [*VISHAY_SIS468DN-T1-GE3]  (value not drawn)
Q5  SI7611DN-T1-GE3  Supplier Part Number 1: SI7611DN-T1-GE3CT-ND  [*VISHAY_SIS468DN-T1-GE3]
R1  Resistance (Ohms): 4.99k  [RESC0805(2012)_L]
R2  Resistance (Ohms): 4.99k  [RESC0805(2012)_L]
R3  Resistance (Ohms): 6.98k  [RESC0805(2012)_N]  (hidden comment: 6K98 1% 0805(2012))
R4  Resistance (Ohms): 75  [RESC0805(2012)_L]
R5  Resistance (Ohms): 75  [RESC0805(2012)_L]
R6  Resistance (Ohms): 6.98k  [RESC0805(2012)_N]  (hidden comment: 6K98 1% 0805(2012))
R7  Resistance (Ohms): 4.99k  [RESC0805(2012)_L]
R8  Resistance (Ohms): 4.99k  [RESC0805(2012)_L]
R9  Resistance (Ohms): 75  [RESC0805(2012)_L]
R10  Resistance (Ohms): 75  [RESC0805(2012)_L]
R11  Resistance (Ohms): 6.98k  [RESC0805(2012)_N]  (hidden comment: 6K98 1% 0805(2012))
R12  Resistance (Ohms): 4.99k  [RESC0805(2012)_L]
R14  Resistance (Ohms): 6.98k  [RESC0805(2012)_N]  (hidden comment: 6K98 1% 0805(2012))
R15  Resistance (Ohms): 6.98k  [RESC0805(2012)_N]  (hidden comment: 6K98 1% 0805(2012))
R16  Resistance (Ohms): 75  [RESC0805(2012)_L]
R18  Resistance (Ohms): 6.98k  [RESC0805(2012)_N]  (hidden comment: 6K98 1% 0805(2012))
R20  Resistance (Ohms): 6.98k  [RESC0805(2012)_N]  (hidden comment: 6K98 1% 0805(2012))
U1  CD74HC4050PWR  Supplier Part Number 1: 296-9215-1-ND  [PW0016A_N]

### Ports
PA3, PA4, PA5, PB1, PC0, PD15, PF7, PF9, PG3, PG4, PG5, PG6

### Nets
+3.3: U1.1(VCC)
+5: R3.2 R6.2 R11.1 R14.1 R15.2 R18.1 R20.1
+12: DS1.1(A) DS2.1(A) DS3.1(A) DS4.1(A) DS5.1(A) P2.3 P2.7 P2.11 P2.15 P2.19
GND: P2.4 P2.8 P2.12 P2.16 P2.20 P2.24 P2.28 Q1.5(D) Q1.6(D) Q1.7(D) Q1.8(D) Q1.9(D) Q2.5(D) Q2.6(D) Q2.7(D) Q2.8(D) Q2.9(D) Q3.5(D) Q3.6(D) Q3.7(D) Q3.8(D) Q3.9(D) Q4.5(D) Q4.6(D) Q4.7(D) Q4.8(D) Q4.9(D) Q5.5(D) Q5.6(D) Q5.7(D) Q5.8(D) Q5.9(D) U1.8(GND)
Arrestment Heater FET: R9.1 U1.2(1Y)
Arrestment Htr Out: P2.9 Q3.1(S) Q3.2(S) Q3.3(S) R8.2
Arrestment Htr_LED: DS4.2(K) R8.1
Board1 Heater FET: R16.1 U1.12(5Y)
Board1 Htr Out: P2.17 Q5.1(S) Q5.2(S) Q5.3(S) R12.1
Board1_Htr LED: DS5.2(K) R12.2
Conning Tower Heater FET: R4.1 U1.4(2Y)
Conning Tower Htr Out: P2.5 Q1.1(S) Q1.2(S) Q1.3(S) R1.1
Conning Tower Htr_LED: DS1.2(K) R1.2
Gearbox Heater FET: R10.1 U1.6(3Y)
Gearbox Htr Out: P2.1 Q4.1(S) Q4.2(S) Q4.3(S) R7.1
Gearbox Htr_LED: DS3.2(K) R7.2
Meter Heater FET: R5.1 U1.15(6Y)
Meter_Htr_LED: DS2.2(K) R2.1
Meter_Htr_Out: P2.13 Q2.1(S) Q2.2(S) Q2.3(S) R2.2
PA3: P2.10 R11.2 ; port PA3
PA4: P2.18 R14.2 ; port PA4
PA5: P2.22 R15.1 ; port PA5
PB1: P2.14 R3.1 ; port PB1
PC0: P2.6 R6.1 ; port PC0
PD15: U1.11(5A) ; port PD15
PF7: P2.26 R18.2 ; port PF7
PF9: P2.2 R20.2 ; port PF9
PG3: U1.7(3A) ; port PG3
PG4: U1.5(2A) ; port PG4
PG5: U1.3(1A) ; port PG5
PG6: U1.14(6A) ; port PG6
NetQ1_4: Q1.4(G) R4.2
NetQ2_4: Q2.4(G) R5.2
NetQ3_4: Q3.4(G) R9.2
NetQ4_4: Q4.4(G) R10.2
NetQ5_4: Q5.4(G) R16.2

Not connected (* = marked no-connect by the designer): P2 21* 23* 25* 27* 29* 30*; U1 9(4A)* 10(4Y)* 13(NC)* 16(NC)*

### Notes on the sheet
- SI7114DN-T1-E3
- (near U1) Arrestment Heater
- (near U1) Conning Tower Heater
- (near U1) Gearbox Heater
- (near U1) Board1 Heater
- (near U1) Meter Heater
- (near P2) Lid Thermistor
- (near P2) Arrestment Thermistor
- (near P2) Gearbox Thermistor
- (near P2) Conning Tower Thermistor
- (near P2) Meter Thermistor 1
- (near P2) Meter Thermistor 2
- (near P2) Board1 Thermistor
- Title
- Size:
- Date:
- Tabloid
- Number:
- Time:
- Revision:
- Sheet
- of
- ZLS Corporation
- 7801 North Lamar Blvd.
- Suite E-184
- Austin, Texas 78752  USA
- (512) 453-0288
- File:

### Library data of the parts
DS1-DS5 = LED A/K: Manufacturer: Vishay / Lite-On; Lens Colour: Colorless; Lens Style: Diffused,Colorless; Viewing Angle: 130°; Luminous Intensity: 54mcd; Forward Current: 20mA; Forward Voltage: 2V; Power Rating: 75mW; Dominant Wavelength: 631nm; Lens Transparency: Clear; Number of Elements: 1; Wavelength: 639nm; Supplier 1: Digi-Key; Supplier Part Number 1: 160-1469-1-ND; Stock 1: 108191; Pricing 1: 1=0.31, 10=0.225, 25=0.1656, 100=0.1183, 250=0.0804, 500=0.071, 1000=0.0556 (USD); Mount: Surface Mount; Case/Package: 0805; Number of Pins: 2; Colour: Red; Case Code (Metric): 2012; Case Code (Imperial): 0805; Min Operating Temperature: -55°C; Max Operating Temperature: 85°C; Packaging: Tape and Reel; Package Quantity: 4000; Illumination Colour: Red; Test Current: 20mA; Power Dissipation: 75mW; Number of LEDs: 1; Length: 2.1mm; Height: 0.6mm; Width: 1mm; Depth: 0.6mm; Radiation Hardening: No; Lead Free: Lead Free; ComponentLink1URL: https://datasheet.ciiva.com/2110/s-110-ltst-s220krkt-2110132.pdf; ComponentLink1Description: https://datasheet.ciiva.com/2110/s-110-ltst-s220krkt-2110132.pdf; ComponentLink2URL: https://datasheet.ciiva.com/2110/s-110-ltst-s220krkt-2110133.pdf; ComponentLink2Description: https://datasheet.ciiva.com/2110/s-110-ltst-s220krkt-2110133.pdf; ComponentLink3URL: https://datasheet.ciiva.com/2110/s-110-ltst-s220krkt-2110134.pdf; ComponentLink3Description: https://datasheet.ciiva.com/2110/s-110-ltst-s220krkt-2110134.pdf; ComponentLink4URL: https://datasheet.ciiva.com/12403/lite-on-ltst-s220krkt-187389-12403798.pdf; ComponentLink4Description: https://datasheet.ciiva.com/12403/lite-on-ltst-s220krkt-187389-12403798.pdf; ComponentLink5URL: https://datasheet.ciiva.com/16345/lite-onltst-s220krkt-16345511.pdf; ComponentLink5Description: https://datasheet.ciiva.com/16345/lite-onltst-s220krkt-16345511.pdf; ComponentLink6URL: https://datasheet.ciiva.com/15118/getdatasheetpartid-225752-15118120.pdf; ComponentLink6Description: https://datasheet.ciiva.com/15118/getdatasheetpartid-225752-15118120.pdf; ComponentLink7URL: https://datasheet.ciiva.com/14633/0900766b80dc0b76-14633737.pdf; ComponentLink7Description: https://datasheet.ciiva.com/14633/0900766b80dc0b76-14633737.pdf; ComponentLink8URL: https://datasheet.ciiva.com/11775/0900766b80dc0b76-11775439.pdf; ComponentLink8Description: https://datasheet.ciiva.com/11775/0900766b80dc0b76-11775439.pdf
P2 = Header 15X2H: Header, 15-Pin, Dual row, Right Angle; Manufacturer: Samtec; Number of Contacts: 30; Gender: Male; Max Voltage Rating (AC): 350V; Current Rating: 2A; Pitch: 1.27mm; LatestRevisionDate: 17-Jul-2002; LatestRevisionNote: Re-released for DXP Platform.; Publisher: Altium Limited; Supplier 1: Digi-Key; Manufacturer Part Number: TFM-115-02-S-D-A; Stock 1: 262; Pricing 1: 1=6.02000, 26=5.27115, 104=4.76904, 520=4.01600, 1014=3.51400 (USD); RoHS: Yes; Contact Plating: Gold; Contact Material: Bronze; Housing Color: Black; Housing Material: Polymer; Min Operating Temperature: -55°C; Max Operating Temperature: 125°C; Number of Rows: 2; Termination: Solder; Packaging: Bulk; Orientation: Straight; Voltage Rating: 350V; Length: 22.23mm; Depth: 5.72mm; Radiation Hardening: No; REACH SVHC: No SVHC; ComponentLink1URL: https://datasheet.ciiva.com/23730/tfm-1xx-xx-xxx-x-xxx-mkt-23730881.pdf?src-supplier=Newark; ComponentLink1Description: https://datasheet.ciiva.com/23730/tfm-1xx-xx-xxx-x-xxx-mkt-23730881.pdf?src-supplier=Newark; ComponentLink2URL: https://datasheet.ciiva.com/11748/0900766b803e8a8f-11748828.pdf?src-supplier=RSComponents; ComponentLink2Description: https://datasheet.ciiva.com/11748/0900766b803e8a8f-11748828.pdf?src-supplier=RSComponents; ComponentLink3URL: https://datasheet.ciiva.com/22665/1909334-22665886.pdf?src-supplier=Element14; ComponentLink3Description: https://datasheet.ciiva.com/22665/1909334-22665886.pdf?src-supplier=Element14
Q1-Q5 = SI7611DN-T1-GE3: P-Channel 40 V 0.025 Ohm 39 W Surface Mount Power Mosfet - PowerPAK-1212-8; MF: Vishay Siliconix; Rds On Max: 25mR; Input Capacitance: 1.98nF; Nominal Vgs: -3V; Rise Time: 11ns; Drain to Source Voltage (Vdss): 40V; Continuous Drain Current (ID): 9.3A; Max Power Dissipation: 39W; Gate to Source Voltage (Vgs): 20V; Fall Time: 9ns; Turn-Off Delay Time: 30ns; Threshold Voltage: -1V; Number of Elements: 1; Power Dissipation: 3.7W; Drain to Source Breakdown Voltage: -40V; Turn-On Delay Time: 10ns; Digi-Key_Part_Number: SI7611DN-T1-GE3CT-ND; Package: PowerPAKÂ®-1212 Vishay; SnapEDA_Link: https://www.snapeda.com/parts/SI7611DN-T1-GE3/Vishay%20Siliconix/view-part/?ref=snap; Digi-Key_Purchase_URL: https://www.digikey.com/product-detail/en/vishay-siliconix/SI7611DN-T1-GE3/SI7611DN-T1-GE3CT-ND/1978912?utm_source=snapeda&utm_medium=aggregator&utm_campaign=symbol; MP: SI7611DN-T1-GE3; Value: *; Supplier 1: Digi-Key; Manufacturer: Vishay Siliconix; Manufacturer Part Number: SI7611DN-T1-GE3; Stock 1: 17511; Pricing 1: 1=1.69000, 10=1.51900, 100=1.22090, 500=1.00310, 1000=0.83113 (USD); RoHS: Yes; Mount: Surface Mount; Number of Pins: 8; Min Operating Temperature: -50°C; Max Operating Temperature: 150°C; Package Quantity: 3000; Packaging: Tape and Reel; Drain to Source Resistance: 25mR; Number of Channels: 1; On-State Resistance: 25mR; Length: 3.05mm; Height: 1.04mm; Width: 3.05mm; Radiation Hardening: No; REACH SVHC: Unknown; Lead Free: Lead Free; ComponentLink1URL: https://datasheet.ciiva.com/16217/si7611dn-16217425.pdf?src-supplier=Future+Electronics; ComponentLink1Description: https://datasheet.ciiva.com/16217/si7611dn-16217425.pdf?src-supplier=Future+Electronics; ComponentLink2URL: https://datasheet.ciiva.com/22652/1719651-22652413.pdf?src-supplier=Element14; ComponentLink2Description: https://datasheet.ciiva.com/22652/1719651-22652413.pdf?src-supplier=Element14; ComponentLink3URL: https://datasheet.ciiva.com/4441/si7611dn-244617-4441134.pdf?src-supplier=Mouser; ComponentLink3Description: https://datasheet.ciiva.com/4441/si7611dn-244617-4441134.pdf?src-supplier=Mouser; ComponentLink4URL: https://datasheet.ciiva.com/26791/si7611dn-t1-ge3-26791896.pdf?src-supplier=IIIC; ComponentLink4Description: https://datasheet.ciiva.com/26791/si7611dn-t1-ge3-26791896.pdf?src-supplier=IIIC; ComponentLink5URL: https://datasheet.ciiva.com/933/si7611dn-933572.pdf?src-supplier=Digi-Key; ComponentLink5Description: https://datasheet.ciiva.com/933/si7611dn-933572.pdf?src-supplier=Digi-Key; ComponentLink6URL: https://datasheet.ciiva.com/933/si7611dn-933574.pdf?src-supplier=Digi-Key; ComponentLink6Description: https://datasheet.ciiva.com/933/si7611dn-933574.pdf?src-supplier=Digi-Key; ComponentLink7URL: https://datasheet.ciiva.com/22671/si7611dn-22671641.pdf?src-supplier=Element14; ComponentLink7Description: https://datasheet.ciiva.com/22671/si7611dn-22671641.pdf?src-supplier=Element14; ComponentLink8URL: https://datasheet.ciiva.com/933/si7611dn-933573.pdf?src-supplier=Digi-Key; ComponentLink8Description: https://datasheet.ciiva.com/933/si7611dn-933573.pdf?src-supplier=Digi-Key; ComponentLink9URL: https://datasheet.ciiva.com/11159/si7611dn-11159816.pdf?src-supplier=Avnet; ComponentLink9Description: https://datasheet.ciiva.com/11159/si7611dn-11159816.pdf?src-supplier=Avnet
  Q4: Supplier Part Number 1: SI7611DN-T1-GE3CT-ND
R1 R2 R7 R8 R12 = CMP-1013-00393-1: Manufacturer: Vishay Dale; Manufacturer Part Number: CRCW08054K99FKEA; Tolerance: ±1%; Power (Watts): 0.125W, 1/8W; Temperature Coefficient: ±100ppm/°C; Supplier 1: Digi-Key; Supplier Part Number 1: 541-4.99KCCT-ND; RoHS: RoHS Compliant; Category: Resistors; Stock 1: 93740; Pricing 1: 1=0.1, 10=0.044, 100=0.0178, 1000=0.00802, 2500=0.00696 (USD); Packaging: Cut Tape (CT); Part Status: Active; Composition: Thick Film; Features: Automotive AEC-Q200; Operating Temperature: -55°C ~ 155°C; Package / Case: 0805 (2012 Metric); Supplier Device Package: 0805; Size / Dimension: 0.079" L x 0.049" W (2.00mm x 1.25mm); Height - Seated (Max): 0.020" (0.50mm); Failure Rate: -; ComponentLink1URL: http://www.vishay.com/docs/20035/dcrcwe3.pdf; ComponentLink1Description: http://www.vishay.com/docs/20035/dcrcwe3.pdf
R3 R6 R11 R14 R15 R18 R20 = CMP-1013-00606-1: 6K98 0.125W 1% 0805 (2012 Metric)  SMD; Manufacturer: Vishay Dale; Manufacturer Part Number: CRCW08056K98FKEA; Power (Watts): 0.125W, 1/8W; Temperature Coefficient: ±100ppm/°C; Supplier 1: Digi-Key; Supplier Part Number 1: 541-6.98KCCT-ND; RoHS: RoHS Compliant; Category: Resistors; Stock 1: 34245; Pricing 1: 1=0.1, 10=0.044, 100=0.0178, 1000=0.00802, 2500=0.00696 (USD); Packaging: Cut Tape (CT); Part Status: Active; Tolerance: ±1%; Composition: Thick Film; Features: Automotive AEC-Q200; Operating Temperature: -55°C ~ 155°C; Package / Case: 0805 (2012 Metric); Supplier Device Package: 0805; Size / Dimension: 0.079" L x 0.049" W (2.00mm x 1.25mm); Height - Seated (Max): 0.020" (0.50mm); Failure Rate: -; ComponentLink1URL: http://www.vishay.com/docs/20035/dcrcwe3.pdf; ComponentLink1Description: http://www.vishay.com/docs/20035/dcrcwe3.pdf
R4 R5 R9 R10 R16 = CMP-1013-00393-1: Manufacturer: Vishay Dale; Manufacturer Part Number: CRCW080575R0FKEA; Tolerance: ±1%; Power (Watts): 0.125W, 1/8W; Temperature Coefficient: ±100ppm/°C; Supplier 1: Digi-Key; Supplier Part Number 1: 541-75.0CCT-ND; RoHS: RoHS Compliant; Category: Resistors; Stock 1: 32546; Pricing 1: 1=0.1, 10=0.044, 100=0.0178, 1000=0.00802, 2500=0.00696 (USD); Packaging: Cut Tape (CT); Part Status: Active; Composition: Thick Film; Features: Automotive AEC-Q200; Operating Temperature: -55°C ~ 155°C; Package / Case: 0805 (2012 Metric); Supplier Device Package: 0805; Size / Dimension: 0.079" L x 0.049" W (2.00mm x 1.25mm); Height - Seated (Max): 0.020" (0.50mm); Failure Rate: -; ComponentLink1URL: http://www.vishay.com/docs/20035/dcrcwe3.pdf; ComponentLink1Description: http://www.vishay.com/docs/20035/dcrcwe3.pdf
U1 = CMP-0440-01131-3: High Speed CMOS Logic Hex Non-Inverting Buffers, PW0016A, LARGE T&R; Manufacturer: Texas Instruments; VCC(Min)(V): 2; Rating: Catalog; tpd @ Nom Voltage(Max)(ns): 18; Voltage(Nom)(V): 6; F @ Nom Voltage(Max)(Mhz): 28; ICC @ Nom Voltage(Max)(mA): 0.02; Propagation Delay: 14ns; Max Supply Voltage: 6V; Min Supply Voltage: 2V; Logic Function: Buffer; Number of Bits per Element: 1; High Level Output Current: -5.2mA; Low Level Output Current: 5.2mA; Quiescent Current: 2uA; Input Type: CMOS; Output Type: CMOS; PackageVersion: http://www.ti.com/lit/ml/mpds361/mpds361.pdf; DatasheetVersion: SCHS205I; Operating Temperature Range(C): -55 to 125; Generic Part Number: CD74HC4050; Code_JEDEC: MO-153; VCC(Max)(V): 6; PackageReference: PW0016A; Bits(#): 6; Supplier 1: Digi-Key; Manufacturer Part Number: CD74HC4050PWR; Stock 1: 16059; Pricing 1: 1=0.45000, 10=0.38600, 100=0.28840, 500=0.22660, 1000=0.17510 (USD); RoHS: Yes; Mount: Surface Mount; Case/Package: TSSOP; Number of Pins: 16; Contact Plating: Gold; Min Operating Temperature: -55°C; Max Operating Temperature: 125°C; Packaging: Tape and Reel; Number of Channels: 6; Number of Inputs: 6; Number of Outputs: 6; Package Quantity: 2000; Number of Elements: 6; Number of Input Lines: 6; Number of Output Lines: 6; Polarity: Non-Inverting; Turn-On Delay Time: 14ns; Number of Bits: 6; Length: 5mm; Height: 1.15mm; Width: 4.4mm; Radiation Hardening: No; REACH SVHC: No SVHC; Lead Free: Lead Free; ComponentLink1URL: https://datasheet.ciiva.com/46415/1847357-46415243.pdf?src-supplier=Element14; ComponentLink1Description: https://datasheet.ciiva.com/46415/1847357-46415243.pdf?src-supplier=Element14; ComponentLink2URL: https://datasheet.ciiva.com/26248/cd74hc4049-26248317.pdf?src-supplier=Avnet+Europe; ComponentLink2Description: https://datasheet.ciiva.com/26248/cd74hc4049-26248317.pdf?src-supplier=Avnet+Europe; ComponentLink3URL: https://datasheet.ciiva.com/1834/cd74hc4049-1834062.pdf?src-supplier=Digi-Key; ComponentLink3Description: https://datasheet.ciiva.com/1834/cd74hc4049-1834062.pdf?src-supplier=Digi-Key; ComponentLink4URL: https://datasheet.ciiva.com/1834/cd74hc4049-1834063.pdf?src-supplier=Digi-Key; ComponentLink4Description: https://datasheet.ciiva.com/1834/cd74hc4049-1834063.pdf?src-supplier=Digi-Key; ComponentLink5URL: https://datasheet.ciiva.com/14302/schs205i-14302309.pdf?src-supplier=Avnet; ComponentLink5Description: https://datasheet.ciiva.com/14302/schs205i-14302309.pdf?src-supplier=Avnet; ComponentLink6URL: https://datasheet.ciiva.com/1834/cd74hc4049-1834061.pdf?src-supplier=Digi-Key; ComponentLink6Description: https://datasheet.ciiva.com/1834/cd74hc4049-1834061.pdf?src-supplier=Digi-Key; ComponentLink7URL: https://datasheet.ciiva.com/41455/001015781-da-01-en-ic-buffer-hex-cd74hc4050pwr-tssop-16-tid-41455717.pdf?src-supplier=Conrad; ComponentLink7Description: https://datasheet.ciiva.com/41455/001015781-da-01-en-ic-buffer-hex-cd74hc4050pwr-tssop-16-tid-41455717.pdf?src-supplier=Conrad

## Nets that join several sheets
+3.3: Connectors (5 pins), Levels (U8.5 U11.5), Heaters (U1.1)
+5: Connectors (5 pins), Levels (9 pins), Heaters (7 pins)
+12: Connectors (CN2.2 CN2.4), Heaters (10 pins)
-5: Connectors (CN2.6 CN2.8), Levels (5 pins)
GND: Connectors (15 pins), Levels (36 pins), Heaters (33 pins)
Cross_Black: Connectors (P1.3), Levels (C9.1)
Cross_Blue: Connectors (P1.5), Levels (U3.1 U3.4)
Long_Black: Connectors (P1.4), Levels (C17.1)
Long_Blue: Connectors (P1.6), Levels (U4.1 U4.4)
PA3: Connectors (CN2.45), Heaters (P2.10 R11.2)
PA4: Connectors (CN1.40), Heaters (P2.18 R14.2)
PA5: Connectors (CN2.19), Heaters (P2.22 R15.1)
PA6: Connectors (CN2.21), Levels (C16.1 U11.1 U11.4)
PB1: Connectors (CN2.32), Heaters (P2.14 R3.1)
PC0: Connectors (CN1.46), Heaters (P2.6 R6.1)
PC6: Connectors (CN2.12), Levels (U2.11 U2.20)
PD15: Connectors (CN2.58), Heaters (U1.11)
PF7: Connectors (CN1.19), Heaters (P2.26 R18.2)
PF9: Connectors (CN1.66), Heaters (P2.2 R20.2)
PF13: Connectors (CN2.67), Levels (C6.1 U8.1 U8.4)
PG3: Connectors (CN1.54), Heaters (U1.7)
PG4: Connectors (CN2.79), Heaters (U1.5)
PG5: Connectors (CN2.78), Heaters (U1.3)
PG6: Connectors (CN2.80), Heaters (U1.14)

## Assembly variants
H743ZI: not fitted C62 C63 C69 C70 C71 C72 CN2 CN11 CN12 R35 R54 R55 R67 SB3 SB4 SB5 SB7 SB9 SB10 SB14 SB15 SB16 SB17 SB18 SB20 SB33 SB34 SB37 SB40 SB41 SB44 SB46 SB47 SB49 SB50 SB55 SB58 SB61 SB62 SB65 SB66 SB69 SB70 SB78 SB79 X3
H7A3ZI: not fitted C62 C63 C69 C70 C71 C72 C73 C74 C75 C76 C77 C78 C79 C80 C81 C82 C83 C85 CN2 CN11 CN12 CN14 HW3 JP6 L1 R35 R40 R41 R42 R43 R44 R45 R46 R47 R48 R49 R50 R51 R52 R53 R54 R55 R57 R58 R59 R67 R75 R76 R77 R78 SB3 SB4 SB5 SB7 SB9 SB10 SB14 SB15 SB16 SB17 SB18 SB20 SB27 SB29 SB30 SB31 SB34 SB35 SB36 SB38 SB40 SB41 SB44 SB46 SB47 SB48 SB54 SB55 SB57 SB58 SB60 SB61 SB62 SB64 SB66 SB69 SB70 SB72 SB74 SB78 SB79 U15 U16 U17 X3 X4
H7B3ZI: not fitted C62 C63 C69 C70 C71 C72 C73 C74 C75 C76 C77 C78 C79 C80 C81 C82 C83 C85 CN2 CN11 CN12 CN14 HW3 JP6 L1 R35 R40 R41 R42 R43 R44 R45 R46 R47 R48 R49 R50 R51 R52 R53 R54 R55 R57 R58 R59 R67 R75 R76 R77 R78 SB3 SB4 SB5 SB7 SB9 SB10 SB14 SB15 SB16 SB17 SB18 SB20 SB27 SB29 SB30 SB31 SB34 SB35 SB36 SB38 SB40 SB41 SB44 SB46 SB47 SB48 SB54 SB55 SB57 SB58 SB60 SB61 SB62 SB64 SB66 SB69 SB70 SB72 SB74 SB78 SB79 U15 U16 U17 X3 X4
H753ZI: not fitted C62 C63 C69 C70 C71 C72 CN2 CN11 CN12 R35 R54 R55 R67 SB3 SB4 SB5 SB7 SB9 SB10 SB14 SB15 SB16 SB17 SB18 SB20 SB33 SB34 SB37 SB40 SB41 SB44 SB46 SB47 SB49 SB50 SB55 SB58 SB61 SB62 SB65 SB66 SB69 SB70 SB78 SB79 X3